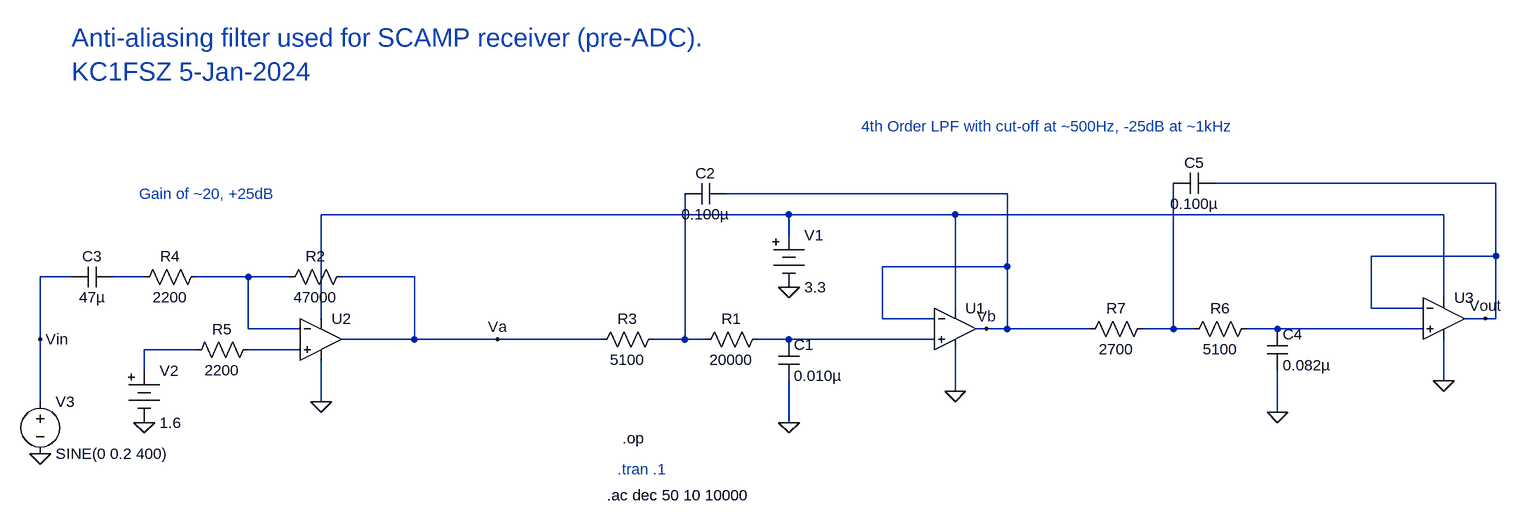
[diagram p0: schematic Antialiasing Filter.asc]
Antialiasing Filter.asc, the LTspice schematic file:
Version 4
SHEET 1 1288 680
WIRE 1264 80 832 80
WIRE 512 96 80 96
WIRE 176 128 -544 128
WIRE 432 128 176 128
WIRE 1184 128 432 128
WIRE 176 160 176 128
WIRE 1264 192 1264 80
WIRE 1264 192 1072 192
WIRE 512 208 512 96
WIRE 512 208 320 208
WIRE -928 224 -976 224
WIRE -816 224 -864 224
WIRE -656 224 -736 224
WIRE -592 224 -656 224
WIRE -400 224 -512 224
WIRE 1184 256 1184 128
WIRE 432 272 432 128
WIRE 1072 272 1072 192
WIRE 1152 272 1072 272
WIRE -544 288 -544 128
WIRE 320 288 320 208
WIRE 400 288 320 288
WIRE 1248 288 1216 288
WIRE 1264 288 1264 192
WIRE 1264 288 1248 288
WIRE -656 304 -656 224
WIRE -576 304 -656 304
WIRE 480 304 464 304
WIRE 512 304 512 208
WIRE 512 304 480 304
WIRE 640 304 512 304
WIRE 768 304 768 80
WIRE 768 304 720 304
WIRE 800 304 768 304
WIRE 928 304 880 304
WIRE 1152 304 928 304
WIRE -976 320 -976 224
WIRE -400 320 -400 224
WIRE -400 320 -512 320
WIRE -272 320 -400 320
WIRE -112 320 -272 320
WIRE 16 320 16 96
WIRE 16 320 -32 320
WIRE 48 320 16 320
WIRE 176 320 128 320
WIRE 400 320 176 320
WIRE -736 336 -816 336
WIRE -576 336 -656 336
WIRE -816 368 -816 336
WIRE 1184 384 1184 320
WIRE 432 400 432 336
WIRE -976 416 -976 320
WIRE -544 416 -544 352
WIRE 928 432 928 368
WIRE 176 448 176 384
FLAG 176 240 0
FLAG 176 448 0
FLAG -976 496 0
FLAG 432 400 0
FLAG -544 416 0
FLAG -816 448 0
FLAG -272 320 Va
FLAG -976 320 Vin
FLAG 928 432 0
FLAG 1184 384 0
FLAG 1248 288 Vout
FLAG 480 304 Vb
SYMBOL OpAmps/UniversalOpAmp 432 304 R0
SYMATTR InstName U1
SYMBOL voltage -976 400 R0
SYMATTR InstName V3
SYMATTR Value SINE(0 0.2 400)
SYMATTR Value2 AC 1
SYMBOL res 144 304 R90
WINDOW 0 0 56 VBottom 2
WINDOW 3 32 56 VTop 2
SYMATTR InstName R1
SYMATTR Value 20000
SYMBOL res -16 304 R90
WINDOW 0 0 56 VBottom 2
WINDOW 3 32 56 VTop 2
SYMATTR InstName R3
SYMATTR Value 5100
SYMBOL cap 160 320 R0
SYMATTR InstName C1
SYMATTR Value 0.010µ
SYMBOL cap 80 80 R90
WINDOW 0 0 32 VBottom 2
WINDOW 3 32 32 VTop 2
SYMATTR InstName C2
SYMATTR Value 0.100µ
SYMBOL Misc/battery 176 144 R0
SYMATTR InstName V1
SYMATTR Value 3.3
SYMBOL OpAmps/UniversalOpAmp -544 320 R0
SYMATTR InstName U2
SYMBOL res -496 208 R90
WINDOW 0 0 56 VBottom 2
WINDOW 3 32 56 VTop 2
SYMATTR InstName R2
SYMATTR Value 47000
SYMBOL res -720 208 R90
WINDOW 0 0 56 VBottom 2
WINDOW 3 32 56 VTop 2
SYMATTR InstName R4
SYMATTR Value 2200
SYMBOL Misc/battery -816 352 R0
SYMATTR InstName V2
SYMATTR Value 1.6
SYMBOL cap -864 208 R90
WINDOW 0 0 32 VBottom 2
WINDOW 3 32 32 VTop 2
SYMATTR InstName C3
SYMATTR Value 47µ
SYMBOL res -640 320 R90
WINDOW 0 0 56 VBottom 2
WINDOW 3 32 56 VTop 2
SYMATTR InstName R5
SYMATTR Value 2200
SYMBOL OpAmps/UniversalOpAmp 1184 288 R0
SYMATTR InstName U3
SYMBOL res 896 288 R90
WINDOW 0 0 56 VBottom 2
WINDOW 3 32 56 VTop 2
SYMATTR InstName R6
SYMATTR Value 5100
SYMBOL res 736 288 R90
WINDOW 0 0 56 VBottom 2
WINDOW 3 32 56 VTop 2
SYMATTR InstName R7
SYMATTR Value 2700
SYMBOL cap 912 304 R0
SYMATTR InstName C4
SYMATTR Value 0.082µ
SYMBOL cap 832 64 R90
WINDOW 0 0 32 VBottom 2
WINDOW 3 32 32 VTop 2
SYMATTR InstName C5
SYMATTR Value 0.100µ
TEXT -88 520 Left 2 ;.tran .1
TEXT -104 560 Left 2 !.ac dec 50 10 10000
TEXT -80 472 Left 2 !.op
TEXT 288 -8 Left 2 ;4th Order LPF with cut-off at ~500Hz, -25dB at ~1kHz
TEXT -824 96 Left 2 ;Gain of ~20, +25dB
TEXT -928 -144 Left 4 ;Anti-aliasing filter used for SCAMP receiver (pre-ADC).\nKC1FSZ 5-Jan-2024

The netlist it stands for:
* Antialiasing Filter.asc
XU1 N007 Vb N001 0 Vb level1 Avol=1Meg GBW=10Meg Vos=0 En=0 Enk=0 In=0 Ink=0 Rin=500Meg  ; pins In+ In- V+ V- OUT
V3 Vin 0 SINE(0 0.2 400) AC 1
R1 N007 N006 20000
R3 N006 Va 5100
C1 N007 0 0.010µ
C2 Vb N006 0.100µ
V1 N001 0 3.3
XU2 N009 N003 N001 0 Va level1 Avol=1Meg GBW=10Meg Vos=0 En=0 Enk=0 In=0 Ink=0 Rin=500Meg  ; pins In+ In- V+ V- OUT
R2 Va N003 47000
R4 N003 N002 2200
V2 N008 0 1.6
C3 N002 Vin 47µ
R5 N009 N008 2200
XU3 N005 Vout N001 0 Vout level1 Avol=1Meg GBW=10Meg Vos=0 En=0 Enk=0 In=0 Ink=0 Rin=500Meg  ; pins In+ In- V+ V- OUT
R6 N005 N004 5100
R7 N004 Vb 2700
C4 N005 0 0.082µ
C5 Vout N004 0.100µ
* .tran .1
.ac dec 50 10 10000
.op
* 4th Order LPF with cut-off at ~500Hz, -25dB at ~1kHz
* Gain of ~20, +25dB
* Anti-aliasing filter used for SCAMP receiver (pre-ADC).
* KC1FSZ 5-Jan-2024
.lib UniversalOpAmp1.lib
.backanno
.end